# EasyEDA schematic schematic.json
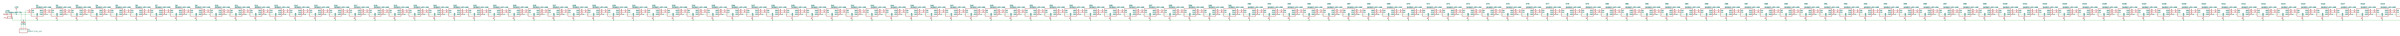
[diagram p0: schematic sheet]

## Parts
D1  SK9822 LED LINK  [SK9822 LED]
D2  SK9822 LED LINK  [SK9822 LED]
D3  SK9822 LED LINK  [SK9822 LED]
D4  SK9822 LED LINK  [SK9822 LED]
D5  SK9822 LED LINK  [SK9822 LED]
D6  SK9822 LED LINK  [SK9822 LED]
D7  SK9822 LED LINK  [SK9822 LED]
D8  SK9822 LED LINK  [SK9822 LED]
D9  SK9822 LED LINK  [SK9822 LED]
D10  SK9822 LED LINK  [SK9822 LED]
D11  SK9822 LED LINK  [SK9822 LED]
D12  SK9822 LED LINK  [SK9822 LED]
D13  SK9822 LED LINK  [SK9822 LED]
D14  SK9822 LED LINK  [SK9822 LED]
D15  SK9822 LED LINK  [SK9822 LED]
D16  SK9822 LED LINK  [SK9822 LED]
D17  SK9822 LED LINK  [SK9822 LED]
D18  SK9822 LED LINK  [SK9822 LED]
D19  SK9822 LED LINK  [SK9822 LED]
D20  SK9822 LED LINK  [SK9822 LED]
D21  SK9822 LED LINK  [SK9822 LED]
D22  SK9822 LED LINK  [SK9822 LED]
D23  SK9822 LED LINK  [SK9822 LED]
D24  SK9822 LED LINK  [SK9822 LED]
D25  SK9822 LED LINK  [SK9822 LED]
D26  SK9822 LED LINK  [SK9822 LED]
D27  SK9822 LED LINK  [SK9822 LED]
D28  SK9822 LED LINK  [SK9822 LED]
D29  SK9822 LED LINK  [SK9822 LED]
D30  SK9822 LED LINK  [SK9822 LED]
D31  SK9822 LED LINK  [SK9822 LED]
D32  SK9822 LED LINK  [SK9822 LED]
D33  SK9822 LED LINK  [SK9822 LED]
D34  SK9822 LED LINK  [SK9822 LED]
D35  SK9822 LED LINK  [SK9822 LED]
D36  SK9822 LED LINK  [SK9822 LED]
D37  SK9822 LED LINK  [SK9822 LED]
D38  SK9822 LED LINK  [SK9822 LED]
D39  SK9822 LED LINK  [SK9822 LED]
D40  SK9822 LED LINK  [SK9822 LED]
D41  SK9822 LED LINK  [SK9822 LED]
D42  SK9822 LED LINK  [SK9822 LED]
D43  SK9822 LED LINK  [SK9822 LED]
D44  SK9822 LED LINK  [SK9822 LED]
D45  SK9822 LED LINK  [SK9822 LED]
D46  SK9822 LED LINK  [SK9822 LED]
D47  SK9822 LED LINK  [SK9822 LED]
D48  SK9822 LED LINK  [SK9822 LED]
D49  SK9822 LED LINK  [SK9822 LED]
D50  SK9822 LED LINK  [SK9822 LED]
D51  SK9822 LED LINK  [SK9822 LED]
D52  SK9822 LED LINK  [SK9822 LED]
D53  SK9822 LED LINK  [SK9822 LED]
D54  SK9822 LED LINK  [SK9822 LED]
D55  SK9822 LED LINK  [SK9822 LED]
D56  SK9822 LED LINK  [SK9822 LED]
D57  SK9822 LED LINK  [SK9822 LED]
D58  SK9822 LED LINK  [SK9822 LED]
D59  SK9822 LED LINK  [SK9822 LED]
D60  SK9822 LED LINK  [SK9822 LED]
D61  SK9822 LED LINK  [SK9822 LED]
D62  SK9822 LED LINK  [SK9822 LED]
D63  SK9822 LED LINK  [SK9822 LED]
D64  SK9822 LED LINK  [SK9822 LED]
D65  SK9822 LED LINK  [SK9822 LED]
D66  SK9822 LED LINK  [SK9822 LED]
D67  SK9822 LED LINK  [SK9822 LED]
D68  SK9822 LED LINK  [SK9822 LED]
D69  SK9822 LED LINK  [SK9822 LED]
D70  SK9822 LED LINK  [SK9822 LED]
D71  SK9822 LED LINK  [SK9822 LED]
D72  SK9822 LED LINK  [SK9822 LED]
D73  SK9822 LED LINK  [SK9822 LED]
D74  SK9822 LED LINK  [SK9822 LED]
D75  SK9822 LED LINK  [SK9822 LED]
D76  SK9822 LED LINK  [SK9822 LED]
D77  SK9822 LED LINK  [SK9822 LED]
D78  SK9822 LED LINK  [SK9822 LED]
D79  SK9822 LED LINK  [SK9822 LED]
D80  SK9822 LED LINK  [SK9822 LED]
D81  SK9822 LED LINK  [SK9822 LED]
D82  SK9822 LED LINK  [SK9822 LED]
D83  SK9822 LED LINK  [SK9822 LED]
D84  SK9822 LED LINK  [SK9822 LED]
D85  SK9822 LED LINK  [SK9822 LED]
D86  SK9822 LED LINK  [SK9822 LED]
D87  SK9822 LED LINK  [SK9822 LED]
D88  SK9822 LED LINK  [SK9822 LED]
D89  SK9822 LED LINK  [SK9822 LED]
D90  SK9822 LED LINK  [SK9822 LED]
D91  SK9822 LED LINK  [SK9822 LED]
D92  SK9822 LED LINK  [SK9822 LED]
D93  SK9822 LED LINK  [SK9822 LED]
D94  SK9822 LED LINK  [SK9822 LED]
D95  SK9822 LED LINK  [SK9822 LED]
D96  SK9822 LED LINK  [SK9822 LED]
D97  SK9822 LED LINK  [SK9822 LED]
D98  SK9822 LED LINK  [SK9822 LED]
D99  SK9822 LED LINK  [SK9822 LED]
D100  SK9822 LED LINK  [SK9822 LED]
D101  SK9822 LED LINK  [SK9822 LED]
D102  SK9822 LED LINK  [SK9822 LED]
D103  SK9822 LED LINK  [SK9822 LED]
D104  SK9822 LED LINK  [SK9822 LED]
D105  SK9822 LED LINK  [SK9822 LED]
D106  SK9822 LED LINK  [SK9822 LED]
D107  SK9822 LED LINK  [SK9822 LED]
D108  SK9822 LED LINK  [SK9822 LED]
D109  SK9822 LED LINK  [SK9822 LED]
D110  SK9822 LED LINK  [SK9822 LED]
D111  SK9822 LED LINK  [SK9822 LED]
D112  SK9822 LED LINK  [SK9822 LED]
D113  SK9822 LED LINK  [SK9822 LED]
D114  SK9822 LED LINK  [SK9822 LED]
D115  SK9822 LED LINK  [SK9822 LED]
D116  SK9822 LED LINK  [SK9822 LED]
D117  SK9822 LED LINK  [SK9822 LED]
D118  SK9822 LED LINK  [SK9822 LED]
D119  SK9822 LED LINK  [SK9822 LED]
D120  SK9822 LED LINK  [SK9822 LED]
D121  SK9822 LED LINK  [SK9822 LED]
D122  SK9822 LED LINK  [SK9822 LED]
D123  SK9822 LED LINK  [SK9822 LED]
D124  SK9822 LED LINK  [SK9822 LED]
D125  SK9822 LED LINK  [SK9822 LED]
D126  SK9822 LED LINK  [SK9822 LED]
D127  SK9822 LED LINK  [SK9822 LED]
D128  SK9822 LED LINK  [SK9822 LED]
D129  SK9822 LED LINK  [SK9822 LED]
D130  SK9822 LED LINK  [SK9822 LED]
D131  SK9822 LED LINK  [SK9822 LED]
D132  SK9822 LED LINK  [SK9822 LED]
D133  SK9822 LED LINK  [SK9822 LED]
D134  SK9822 LED LINK  [SK9822 LED]
D135  SK9822 LED LINK  [SK9822 LED]
D136  SK9822 LED LINK  [SK9822 LED]
D137  SK9822 LED LINK  [SK9822 LED]
D138  SK9822 LED LINK  [SK9822 LED]
D139  SK9822 LED LINK  [SK9822 LED]
D140  SK9822 LED LINK  [SK9822 LED]
D141  SK9822 LED LINK  [SK9822 LED]
D142  SK9822 LED LINK  [SK9822 LED]
D143  SK9822 LED LINK  [SK9822 LED]
D144  SK9822 LED LINK  [SK9822 LED]
D145  SK9822 LED LINK  [SK9822 LED]
D146  SK9822 LED LINK  [SK9822 LED]
D147  SK9822 LED LINK  [SK9822 LED]
D148  SK9822 LED LINK  [SK9822 LED]
D149  SK9822 LED LINK  [SK9822 LED]
D150  SK9822 LED LINK  [SK9822 LED]
D151  SK9822 LED LINK  [SK9822 LED]
D152  SK9822 LED LINK  [SK9822 LED]
D153  SK9822 LED LINK  [SK9822 LED]
D154  SK9822 LED LINK  [SK9822 LED]
D155  SK9822 LED LINK  [SK9822 LED]
D156  SK9822 LED LINK  [SK9822 LED]
D157  SK9822 LED LINK  [SK9822 LED]
D158  SK9822 LED LINK  [SK9822 LED]
D159  SK9822 LED LINK  [SK9822 LED]
D160  SK9822 LED LINK  [SK9822 LED]
D161  SK9822 LED LINK  [SK9822 LED]
D162  SK9822 LED LINK  [SK9822 LED]
D163  SK9822 LED LINK  [SK9822 LED]
D164  SK9822 LED LINK  [SK9822 LED]
D165  SK9822 LED LINK  [SK9822 LED]
D166  SK9822 LED LINK  [SK9822 LED]
D167  SK9822 LED LINK  [SK9822 LED]
D168  SK9822 LED LINK  [SK9822 LED]
D169  SK9822 LED LINK  [SK9822 LED]
D170  SK9822 LED LINK  [SK9822 LED]
D171  SK9822 LED LINK  [SK9822 LED]
D172  SK9822 LED LINK  [SK9822 LED]
D173  SK9822 LED LINK  [SK9822 LED]
D174  SK9822 LED LINK  [SK9822 LED]
D175  SK9822 LED LINK  [SK9822 LED]
D176  SK9822 LED LINK  [SK9822 LED]
D177  SK9822 LED LINK  [SK9822 LED]
D178  SK9822 LED LINK  [SK9822 LED]
D179  SK9822 LED LINK  [SK9822 LED]
D180  SK9822 LED LINK  [SK9822 LED]
D181  SK9822 LED LINK  [SK9822 LED]
D182  SK9822 LED LINK  [SK9822 LED]
D183  SK9822 LED LINK  [SK9822 LED]
D184  SK9822 LED LINK  [SK9822 LED]
D185  SK9822 LED LINK  [SK9822 LED]
D186  SK9822 LED LINK  [SK9822 LED]
D187  SK9822 LED LINK  [SK9822 LED]
D188  SK9822 LED LINK  [SK9822 LED]
D189  SK9822 LED LINK  [SK9822 LED]
D190  SK9822 LED LINK  [SK9822 LED]
D191  SK9822 LED LINK  [SK9822 LED]
D192  SK9822 LED LINK  [SK9822 LED]
D193  SK9822 LED LINK  [SK9822 LED]
D194  SK9822 LED LINK  [SK9822 LED]
D195  SK9822 LED LINK  [SK9822 LED]
D196  SK9822 LED LINK  [SK9822 LED]
D197  SK9822 LED LINK  [SK9822 LED]
D198  SK9822 LED LINK  [SK9822 LED]
D199  SK9822 LED LINK  [SK9822 LED]
D200  SK9822 LED LINK  [SK9822 LED]
D201  SK9822 LED LINK  [SK9822 LED]
D202  SK9822 LED LINK  [SK9822 LED]
D203  SK9822 LED LINK  [SK9822 LED]
D204  SK9822 LED LINK  [SK9822 LED]
D205  SK9822 LED LINK  [SK9822 LED]
D206  SK9822 LED LINK  [SK9822 LED]
D207  SK9822 LED LINK  [SK9822 LED]
D208  SK9822 LED LINK  [SK9822 LED]
D209  SK9822 LED LINK  [SK9822 LED]
D210  SK9822 LED LINK  [SK9822 LED]
D211  SK9822 LED LINK  [SK9822 LED]
D212  SK9822 LED LINK  [SK9822 LED]
D213  SK9822 LED LINK  [SK9822 LED]
D214  SK9822 LED LINK  [SK9822 LED]
D215  SK9822 LED LINK  [SK9822 LED]
D216  SK9822 LED LINK  [SK9822 LED]
D217  SK9822 LED LINK  [SK9822 LED]
D218  SK9822 LED LINK  [SK9822 LED]
D219  SK9822 LED LINK  [SK9822 LED]
D220  SK9822 LED LINK  [SK9822 LED]
D221  SK9822 LED LINK  [SK9822 LED]
D222  SK9822 LED LINK  [SK9822 LED]
D223  SK9822 LED LINK  [SK9822 LED]
D224  SK9822 LED LINK  [SK9822 LED]
D225  SK9822 LED LINK  [SK9822 LED]
D226  SK9822 LED LINK  [SK9822 LED]
D227  SK9822 LED LINK  [SK9822 LED]
D228  SK9822 LED LINK  [SK9822 LED]
D229  SK9822 LED LINK  [SK9822 LED]
D230  SK9822 LED LINK  [SK9822 LED]
D231  SK9822 LED LINK  [SK9822 LED]
D232  SK9822 LED LINK  [SK9822 LED]
D233  SK9822 LED LINK  [SK9822 LED]
D234  SK9822 LED LINK  [SK9822 LED]
D235  SK9822 LED LINK  [SK9822 LED]
D236  SK9822 LED LINK  [SK9822 LED]
D237  SK9822 LED LINK  [SK9822 LED]
D238  SK9822 LED LINK  [SK9822 LED]
D239  SK9822 LED LINK  [SK9822 LED]
D240  SK9822 LED LINK  [SK9822 LED]
D241  SK9822 LED LINK  [SK9822 LED]
D242  SK9822 LED LINK  [SK9822 LED]
D243  SK9822 LED LINK  [SK9822 LED]
D244  SK9822 LED LINK  [SK9822 LED]
D245  SK9822 LED LINK  [SK9822 LED]
D246  SK9822 LED LINK  [SK9822 LED]
D247  SK9822 LED LINK  [SK9822 LED]
D248  SK9822 LED LINK  [SK9822 LED]
D249  SK9822 LED LINK  [SK9822 LED]
D250  SK9822 LED LINK  [SK9822 LED]
D251  SK9822 LED LINK  [SK9822 LED]
D252  SK9822 LED LINK  [SK9822 LED]
D253  SK9822 LED LINK  [SK9822 LED]
D254  SK9822 LED LINK  [SK9822 LED]
D255  SK9822 LED LINK  [SK9822 LED]
D256  SK9822 LED LINK  [SK9822 LED]
D257  SK9822 LED LINK  [SK9822 LED]
D258  SK9822 LED LINK  [SK9822 LED]
D259  SK9822 LED LINK  [SK9822 LED]
D260  SK9822 LED LINK  [SK9822 LED]
D261  SK9822 LED LINK  [SK9822 LED]
D262  SK9822 LED LINK  [SK9822 LED]
D263  SK9822 LED LINK  [SK9822 LED]
D264  SK9822 LED LINK  [SK9822 LED]
D265  SK9822 LED LINK  [SK9822 LED]
D266  SK9822 LED LINK  [SK9822 LED]
D267  SK9822 LED LINK  [SK9822 LED]
D268  SK9822 LED LINK  [SK9822 LED]
D269  SK9822 LED LINK  [SK9822 LED]
D270  SK9822 LED LINK  [SK9822 LED]
D271  SK9822 LED LINK  [SK9822 LED]
D272  SK9822 LED LINK  [SK9822 LED]
D273  SK9822 LED LINK  [SK9822 LED]
D274  SK9822 LED LINK  [SK9822 LED]
D275  SK9822 LED LINK  [SK9822 LED]
D276  SK9822 LED LINK  [SK9822 LED]
D277  SK9822 LED LINK  [SK9822 LED]
D278  SK9822 LED LINK  [SK9822 LED]
D279  SK9822 LED LINK  [SK9822 LED]
D280  SK9822 LED LINK  [SK9822 LED]
D281  SK9822 LED LINK  [SK9822 LED]
D282  SK9822 LED LINK  [SK9822 LED]
D283  SK9822 LED LINK  [SK9822 LED]
D284  SK9822 LED LINK  [SK9822 LED]
D285  SK9822 LED LINK  [SK9822 LED]
D286  SK9822 LED LINK  [SK9822 LED]
D287  SK9822 LED LINK  [SK9822 LED]
D288  SK9822 LED LINK  [SK9822 LED]
D289  SK9822 LED LINK  [SK9822 LED]
D290  SK9822 LED LINK  [SK9822 LED]
D291  SK9822 LED LINK  [SK9822 LED]
D292  SK9822 LED LINK  [SK9822 LED]
D293  SK9822 LED LINK  [SK9822 LED]
D294  SK9822 LED LINK  [SK9822 LED]
D295  SK9822 LED LINK  [SK9822 LED]
D296  SK9822 LED LINK  [SK9822 LED]
D297  SK9822 LED LINK  [SK9822 LED]
D298  SK9822 LED LINK  [SK9822 LED]
D299  SK9822 LED LINK  [SK9822 LED]
D300  SK9822 LED LINK  [SK9822 LED]
D301  SK9822 LED LINK  [SK9822 LED]
D302  SK9822 LED LINK  [SK9822 LED]
D303  SK9822 LED LINK  [SK9822 LED]
D304  SK9822 LED LINK  [SK9822 LED]
D305  SK9822 LED LINK  [SK9822 LED]
D306  SK9822 LED LINK  [SK9822 LED]
D307  SK9822 LED LINK  [SK9822 LED]
D308  SK9822 LED LINK  [SK9822 LED]
D309  SK9822 LED LINK  [SK9822 LED]
D310  SK9822 LED LINK  [SK9822 LED]
D311  SK9822 LED LINK  [SK9822 LED]
D312  SK9822 LED LINK  [SK9822 LED]
D313  SK9822 LED LINK  [SK9822 LED]
D314  SK9822 LED LINK  [SK9822 LED]
D315  SK9822 LED LINK  [SK9822 LED]
D316  SK9822 LED LINK  [SK9822 LED]
D317  SK9822 LED LINK  [SK9822 LED]
D318  SK9822 LED LINK  [SK9822 LED]
D319  SK9822 LED LINK  [SK9822 LED]
D320  SK9822 LED LINK  [SK9822 LED]
D321  SK9822 LED LINK  [SK9822 LED]
D322  SK9822 LED LINK  [SK9822 LED]
D323  SK9822 LED LINK  [SK9822 LED]
D324  SK9822 LED LINK  [SK9822 LED]
D325  SK9822 LED LINK  [SK9822 LED]
D326  SK9822 LED LINK  [SK9822 LED]
D327  SK9822 LED LINK  [SK9822 LED]
D328  SK9822 LED LINK  [SK9822 LED]
D329  SK9822 LED LINK  [SK9822 LED]
D330  SK9822 LED LINK  [SK9822 LED]
D331  SK9822 LED LINK  [SK9822 LED]
D332  SK9822 LED LINK  [SK9822 LED]
D333  SK9822 LED LINK  [SK9822 LED]
D334  SK9822 LED LINK  [SK9822 LED]
D335  SK9822 LED LINK  [SK9822 LED]
D336  SK9822 LED LINK  [SK9822 LED]
D337  SK9822 LED LINK  [SK9822 LED]
D338  SK9822 LED LINK  [SK9822 LED]
D339  SK9822 LED LINK  [SK9822 LED]
D340  SK9822 LED LINK  [SK9822 LED]
D341  SK9822 LED LINK  [SK9822 LED]
D342  SK9822 LED LINK  [SK9822 LED]
D343  SK9822 LED LINK  [SK9822 LED]
D344  SK9822 LED LINK  [SK9822 LED]
D345  SK9822 LED LINK  [SK9822 LED]
D346  SK9822 LED LINK  [SK9822 LED]
D347  SK9822 LED LINK  [SK9822 LED]
D348  SK9822 LED LINK  [SK9822 LED]
D349  SK9822 LED LINK  [SK9822 LED]
D350  SK9822 LED LINK  [SK9822 LED]
D351  SK9822 LED LINK  [SK9822 LED]
D352  SK9822 LED LINK  [SK9822 LED]
D353  SK9822 LED LINK  [SK9822 LED]
D354  SK9822 LED LINK  [SK9822 LED]
D355  SK9822 LED LINK  [SK9822 LED]
D356  SK9822 LED LINK  [SK9822 LED]
D357  SK9822 LED LINK  [SK9822 LED]
D358  SK9822 LED LINK  [SK9822 LED]
D359  SK9822 LED LINK  [SK9822 LED]
D360  SK9822 LED LINK  [SK9822 LED]
D361  SK9822 LED LINK  [SK9822 LED]
D362  SK9822 LED LINK  [SK9822 LED]
D363  SK9822 LED LINK  [SK9822 LED]
D364  SK9822 LED LINK  [SK9822 LED]
D365  SK9822 LED LINK  [SK9822 LED]
D366  SK9822 LED LINK  [SK9822 LED]
D367  SK9822 LED LINK  [SK9822 LED]
D368  SK9822 LED LINK  [SK9822 LED]
D369  SK9822 LED LINK  [SK9822 LED]
D370  SK9822 LED LINK  [SK9822 LED]
D371  SK9822 LED LINK  [SK9822 LED]
D372  SK9822 LED LINK  [SK9822 LED]
D373  SK9822 LED LINK  [SK9822 LED]
D374  SK9822 LED LINK  [SK9822 LED]
D375  SK9822 LED LINK  [SK9822 LED]
D376  SK9822 LED LINK  [SK9822 LED]
D377  SK9822 LED LINK  [SK9822 LED]
D378  SK9822 LED LINK  [SK9822 LED]
D379  SK9822 LED LINK  [SK9822 LED]
D380  SK9822 LED LINK  [SK9822 LED]
D381  SK9822 LED LINK  [SK9822 LED]
D382  SK9822 LED LINK  [SK9822 LED]
D383  SK9822 LED LINK  [SK9822 LED]
D384  SK9822 LED LINK  [SK9822 LED]
D385  SK9822 LED LINK  [SK9822 LED]
D386  SK9822 LED LINK  [SK9822 LED]
D387  SK9822 LED LINK  [SK9822 LED]
D388  SK9822 LED LINK  [SK9822 LED]
D389  SK9822 LED LINK  [SK9822 LED]
D390  SK9822 LED LINK  [SK9822 LED]
D391  SK9822 LED LINK  [SK9822 LED]
D392  SK9822 LED LINK  [SK9822 LED]
D393  SK9822 LED LINK  [SK9822 LED]
D394  SK9822 LED LINK  [SK9822 LED]
D395  SK9822 LED LINK  [SK9822 LED]
D396  SK9822 LED LINK  [SK9822 LED]
D397  SK9822 LED LINK  [SK9822 LED]
D398  SK9822 LED LINK  [SK9822 LED]
D399  SK9822 LED LINK  [SK9822 LED]
D400  SK9822 LED LINK  [SK9822 LED]
D401  SK9822 LED LINK  [SK9822 LED]
D402  SK9822 LED LINK  [SK9822 LED]
D403  SK9822 LED LINK  [SK9822 LED]
D404  SK9822 LED LINK  [SK9822 LED]
D405  SK9822 LED LINK  [SK9822 LED]
D406  SK9822 LED LINK  [SK9822 LED]
D407  SK9822 LED LINK  [SK9822 LED]
D408  SK9822 LED LINK  [SK9822 LED]
D409  SK9822 LED LINK  [SK9822 LED]
D410  SK9822 LED LINK  [SK9822 LED]
D411  SK9822 LED LINK  [SK9822 LED]
D412  SK9822 LED LINK  [SK9822 LED]
D413  SK9822 LED LINK  [SK9822 LED]
D414  SK9822 LED LINK  [SK9822 LED]
D415  SK9822 LED LINK  [SK9822 LED]
D416  SK9822 LED LINK  [SK9822 LED]
D417  SK9822 LED LINK  [SK9822 LED]
D418  SK9822 LED LINK  [SK9822 LED]
D419  SK9822 LED LINK  [SK9822 LED]
D420  SK9822 LED LINK  [SK9822 LED]
D421  SK9822 LED LINK  [SK9822 LED]
D422  SK9822 LED LINK  [SK9822 LED]
D423  SK9822 LED LINK  [SK9822 LED]
D424  SK9822 LED LINK  [SK9822 LED]
D425  SK9822 LED LINK  [SK9822 LED]
D426  SK9822 LED LINK  [SK9822 LED]
D427  SK9822 LED LINK  [SK9822 LED]
D428  SK9822 LED LINK  [SK9822 LED]
D429  SK9822 LED LINK  [SK9822 LED]
D430  SK9822 LED LINK  [SK9822 LED]
D431  SK9822 LED LINK  [SK9822 LED]
D432  SK9822 LED LINK  [SK9822 LED]
D433  SK9822 LED LINK  [SK9822 LED]
D434  SK9822 LED LINK  [SK9822 LED]
D435  SK9822 LED LINK  [SK9822 LED]
D436  SK9822 LED LINK  [SK9822 LED]
D437  SK9822 LED LINK  [SK9822 LED]
D438  SK9822 LED LINK  [SK9822 LED]
D439  SK9822 LED LINK  [SK9822 LED]
D440  SK9822 LED LINK  [SK9822 LED]
D441  SK9822 LED LINK  [SK9822 LED]
D442  SK9822 LED LINK  [SK9822 LED]
D443  SK9822 LED LINK  [SK9822 LED]
D444  SK9822 LED LINK  [SK9822 LED]
D445  SK9822 LED LINK  [SK9822 LED]
D446  SK9822 LED LINK  [SK9822 LED]
D447  SK9822 LED LINK  [SK9822 LED]
D448  SK9822 LED LINK  [SK9822 LED]
D449  SK9822 LED LINK  [SK9822 LED]
D450  SK9822 LED LINK  [SK9822 LED]
D451  SK9822 LED LINK  [SK9822 LED]
D452  SK9822 LED LINK  [SK9822 LED]
D453  SK9822 LED LINK  [SK9822 LED]
D454  SK9822 LED LINK  [SK9822 LED]
D455  SK9822 LED LINK  [SK9822 LED]
D456  SK9822 LED LINK  [SK9822 LED]
D457  SK9822 LED LINK  [SK9822 LED]
D458  SK9822 LED LINK  [SK9822 LED]
D459  SK9822 LED LINK  [SK9822 LED]
D460  SK9822 LED LINK  [SK9822 LED]
D461  SK9822 LED LINK  [SK9822 LED]
D462  SK9822 LED LINK  [SK9822 LED]
D463  SK9822 LED LINK  [SK9822 LED]
D464  SK9822 LED LINK  [SK9822 LED]
D465  SK9822 LED LINK  [SK9822 LED]
D466  SK9822 LED LINK  [SK9822 LED]
D467  SK9822 LED LINK  [SK9822 LED]
D468  SK9822 LED LINK  [SK9822 LED]
D469  SK9822 LED LINK  [SK9822 LED]
D470  SK9822 LED LINK  [SK9822 LED]
D471  SK9822 LED LINK  [SK9822 LED]
D472  SK9822 LED LINK  [SK9822 LED]
D473  SK9822 LED LINK  [SK9822 LED]
D474  SK9822 LED LINK  [SK9822 LED]
D475  SK9822 LED LINK  [SK9822 LED]
D476  SK9822 LED LINK  [SK9822 LED]
D477  SK9822 LED LINK  [SK9822 LED]
D478  SK9822 LED LINK  [SK9822 LED]
D479  SK9822 LED LINK  [SK9822 LED]
D480  SK9822 LED LINK  [SK9822 LED]
D481  SK9822 LED LINK  [SK9822 LED]
D482  SK9822 LED LINK  [SK9822 LED]
D483  SK9822 LED LINK  [SK9822 LED]
D484  SK9822 LED LINK  [SK9822 LED]
D485  SK9822 LED LINK  [SK9822 LED]
D486  SK9822 LED LINK  [SK9822 LED]
D487  SK9822 LED LINK  [SK9822 LED]
D488  SK9822 LED LINK  [SK9822 LED]
D489  SK9822 LED LINK  [SK9822 LED]
D490  SK9822 LED LINK  [SK9822 LED]
D491  SK9822 LED LINK  [SK9822 LED]
D492  SK9822 LED LINK  [SK9822 LED]
D493  SK9822 LED LINK  [SK9822 LED]
D494  SK9822 LED LINK  [SK9822 LED]
D495  SK9822 LED LINK  [SK9822 LED]
D496  SK9822 LED LINK  [SK9822 LED]
D497  SK9822 LED LINK  [SK9822 LED]
D498  SK9822 LED LINK  [SK9822 LED]
D499  SK9822 LED LINK  [SK9822 LED]
D500  SK9822 LED LINK  [SK9822 LED]
D501  SK9822 LED LINK  [SK9822 LED]
D502  SK9822 LED LINK  [SK9822 LED]
D503  SK9822 LED LINK  [SK9822 LED]
D504  SK9822 LED LINK  [SK9822 LED]
D505  SK9822 LED LINK  [SK9822 LED]
D506  SK9822 LED LINK  [SK9822 LED]
D507  SK9822 LED LINK  [SK9822 LED]
D508  SK9822 LED LINK  [SK9822 LED]
D509  SK9822 LED LINK  [SK9822 LED]
D510  SK9822 LED LINK  [SK9822 LED]
D511  SK9822 LED LINK  [SK9822 LED]
D512  SK9822 LED LINK  [SK9822 LED]
D513  SK9822 LED LINK  [SK9822 LED]
D514  SK9822 LED LINK  [SK9822 LED]
D515  SK9822 LED LINK  [SK9822 LED]
D516  SK9822 LED LINK  [SK9822 LED]
D517  SK9822 LED LINK  [SK9822 LED]
D518  SK9822 LED LINK  [SK9822 LED]
D519  SK9822 LED LINK  [SK9822 LED]
D520  SK9822 LED LINK  [SK9822 LED]
D521  SK9822 LED LINK  [SK9822 LED]
D522  SK9822 LED LINK  [SK9822 LED]
D523  SK9822 LED LINK  [SK9822 LED]
D524  SK9822 LED LINK  [SK9822 LED]
D525  SK9822 LED LINK  [SK9822 LED]
D526  SK9822 LED LINK  [SK9822 LED]
D527  SK9822 LED LINK  [SK9822 LED]
D528  SK9822 LED LINK  [SK9822 LED]
D529  SK9822 LED LINK  [SK9822 LED]
D530  SK9822 LED LINK  [SK9822 LED]
D531  SK9822 LED LINK  [SK9822 LED]
D532  SK9822 LED LINK  [SK9822 LED]
D533  SK9822 LED LINK  [SK9822 LED]
D534  SK9822 LED LINK  [SK9822 LED]
D535  SK9822 LED LINK  [SK9822 LED]
D536  SK9822 LED LINK  [SK9822 LED]
D537  SK9822 LED LINK  [SK9822 LED]
D538  SK9822 LED LINK  [SK9822 LED]
D539  SK9822 LED LINK  [SK9822 LED]
D540  SK9822 LED LINK  [SK9822 LED]
D541  SK9822 LED LINK  [SK9822 LED]
D542  SK9822 LED LINK  [SK9822 LED]
D543  SK9822 LED LINK  [SK9822 LED]
D544  SK9822 LED LINK  [SK9822 LED]
D545  SK9822 LED LINK  [SK9822 LED]
D546  SK9822 LED LINK  [SK9822 LED]
D547  SK9822 LED LINK  [SK9822 LED]
D548  SK9822 LED LINK  [SK9822 LED]
D549  SK9822 LED LINK  [SK9822 LED]
D550  SK9822 LED LINK  [SK9822 LED]
D551  SK9822 LED LINK  [SK9822 LED]
D552  SK9822 LED LINK  [SK9822 LED]
D553  SK9822 LED LINK  [SK9822 LED]
D554  SK9822 LED LINK  [SK9822 LED]
D555  SK9822 LED LINK  [SK9822 LED]
D556  SK9822 LED LINK  [SK9822 LED]
D557  SK9822 LED LINK  [SK9822 LED]
D558  SK9822 LED LINK  [SK9822 LED]
D559  SK9822 LED LINK  [SK9822 LED]
D560  SK9822 LED LINK  [SK9822 LED]
D561  SK9822 LED LINK  [SK9822 LED]
D562  SK9822 LED LINK  [SK9822 LED]
D563  SK9822 LED LINK  [SK9822 LED]
D564  SK9822 LED LINK  [SK9822 LED]
D565  SK9822 LED LINK  [SK9822 LED]
D566  SK9822 LED LINK  [SK9822 LED]
D567  SK9822 LED LINK  [SK9822 LED]
D568  SK9822 LED LINK  [SK9822 LED]
D569  SK9822 LED LINK  [SK9822 LED]
D570  SK9822 LED LINK  [SK9822 LED]
D571  SK9822 LED LINK  [SK9822 LED]
D572  SK9822 LED LINK  [SK9822 LED]
D573  SK9822 LED LINK  [SK9822 LED]
D574  SK9822 LED LINK  [SK9822 LED]
D575  SK9822 LED LINK  [SK9822 LED]
D576  SK9822 LED LINK  [SK9822 LED]
D577  SK9822 LED LINK  [SK9822 LED]
D578  SK9822 LED LINK  [SK9822 LED]
D579  SK9822 LED LINK  [SK9822 LED]
D580  SK9822 LED LINK  [SK9822 LED]
D581  SK9822 LED LINK  [SK9822 LED]
D582  SK9822 LED LINK  [SK9822 LED]
D583  SK9822 LED LINK  [SK9822 LED]
D584  SK9822 LED LINK  [SK9822 LED]
D585  SK9822 LED LINK  [SK9822 LED]
D586  SK9822 LED LINK  [SK9822 LED]
D587  SK9822 LED LINK  [SK9822 LED]
D588  SK9822 LED LINK  [SK9822 LED]
D589  SK9822 LED LINK  [SK9822 LED]
D590  SK9822 LED LINK  [SK9822 LED]
D591  SK9822 LED LINK  [SK9822 LED]
D592  SK9822 LED LINK  [SK9822 LED]
D593  SK9822 LED LINK  [SK9822 LED]
D594  SK9822 LED LINK  [SK9822 LED]
D595  SK9822 LED LINK  [SK9822 LED]
D596  SK9822 LED LINK  [SK9822 LED]
D597  SK9822 LED LINK  [SK9822 LED]
D598  SK9822 LED LINK  [SK9822 LED]
D599  SK9822 LED LINK  [SK9822 LED]
D600  SK9822 LED LINK  [SK9822 LED]
D601  SK9822 LED LINK  [SK9822 LED]
D602  SK9822 LED LINK  [SK9822 LED]
D603  SK9822 LED LINK  [SK9822 LED]
D604  SK9822 LED LINK  [SK9822 LED]
D605  SK9822 LED LINK  [SK9822 LED]
D606  SK9822 LED LINK  [SK9822 LED]
D607  SK9822 LED LINK  [SK9822 LED]
D608  SK9822 LED LINK  [SK9822 LED]
D609  SK9822 LED LINK  [SK9822 LED]
D610  SK9822 LED LINK  [SK9822 LED]
D611  SK9822 LED LINK  [SK9822 LED]
D612  SK9822 LED LINK  [SK9822 LED]
D613  SK9822 LED LINK  [SK9822 LED]
D614  SK9822 LED LINK  [SK9822 LED]
D615  SK9822 LED LINK  [SK9822 LED]
D616  SK9822 LED LINK  [SK9822 LED]
D617  SK9822 LED LINK  [SK9822 LED]
D618  SK9822 LED LINK  [SK9822 LED]
D619  SK9822 LED LINK  [SK9822 LED]
D620  SK9822 LED LINK  [SK9822 LED]
D621  SK9822 LED LINK  [SK9822 LED]
D622  SK9822 LED LINK  [SK9822 LED]
D623  SK9822 LED LINK  [SK9822 LED]
D624  SK9822 LED LINK  [SK9822 LED]
D625  SK9822 LED LINK  [SK9822 LED]
D626  SK9822 LED LINK  [SK9822 LED]
D627  SK9822 LED LINK  [SK9822 LED]
D628  SK9822 LED LINK  [SK9822 LED]
D629  SK9822 LED LINK  [SK9822 LED]
D630  SK9822 LED LINK  [SK9822 LED]
D631  SK9822 LED LINK  [SK9822 LED]
D632  SK9822 LED LINK  [SK9822 LED]
D633  SK9822 LED LINK  [SK9822 LED]
D634  SK9822 LED LINK  [SK9822 LED]
D635  SK9822 LED LINK  [SK9822 LED]
D636  SK9822 LED LINK  [SK9822 LED]
D637  SK9822 LED LINK  [SK9822 LED]
D638  SK9822 LED LINK  [SK9822 LED]
D639  SK9822 LED LINK  [SK9822 LED]
D640  SK9822 LED LINK  [SK9822 LED]
D641  SK9822 LED LINK  [SK9822 LED]
D642  SK9822 LED LINK  [SK9822 LED]
D643  SK9822 LED LINK  [SK9822 LED]
D644  SK9822 LED LINK  [SK9822 LED]
D645  SK9822 LED LINK  [SK9822 LED]
D646  SK9822 LED LINK  [SK9822 LED]
D647  SK9822 LED LINK  [SK9822 LED]
D648  SK9822 LED LINK  [SK9822 LED]
D649  SK9822 LED LINK  [SK9822 LED]
D650  SK9822 LED LINK  [SK9822 LED]
D651  SK9822 LED LINK  [SK9822 LED]
D652  SK9822 LED LINK  [SK9822 LED]
D653  SK9822 LED LINK  [SK9822 LED]
D654  SK9822 LED LINK  [SK9822 LED]
D655  SK9822 LED LINK  [SK9822 LED]
D656  SK9822 LED LINK  [SK9822 LED]
D657  SK9822 LED LINK  [SK9822 LED]
D658  SK9822 LED LINK  [SK9822 LED]
D659  SK9822 LED LINK  [SK9822 LED]
D660  SK9822 LED LINK  [SK9822 LED]
D661  SK9822 LED LINK  [SK9822 LED]
D662  SK9822 LED LINK  [SK9822 LED]
D663  SK9822 LED LINK  [SK9822 LED]
D664  SK9822 LED LINK  [SK9822 LED]
D665  SK9822 LED LINK  [SK9822 LED]
D666  SK9822 LED LINK  [SK9822 LED]
D667  SK9822 LED LINK  [SK9822 LED]
D668  SK9822 LED LINK  [SK9822 LED]
D669  SK9822 LED LINK  [SK9822 LED]
D670  SK9822 LED LINK  [SK9822 LED]
D671  SK9822 LED LINK  [SK9822 LED]
D672  SK9822 LED LINK  [SK9822 LED]
D673  SK9822 LED LINK  [SK9822 LED]
D674  SK9822 LED LINK  [SK9822 LED]
D675  SK9822 LED LINK  [SK9822 LED]
D676  SK9822 LED LINK  [SK9822 LED]
D677  SK9822 LED LINK  [SK9822 LED]
D678  SK9822 LED LINK  [SK9822 LED]
D679  SK9822 LED LINK  [SK9822 LED]
D680  SK9822 LED LINK  [SK9822 LED]
D681  SK9822 LED LINK  [SK9822 LED]
D682  SK9822 LED LINK  [SK9822 LED]
D683  SK9822 LED LINK  [SK9822 LED]
D684  SK9822 LED LINK  [SK9822 LED]
D685  SK9822 LED LINK  [SK9822 LED]
D686  SK9822 LED LINK  [SK9822 LED]
D687  SK9822 LED LINK  [SK9822 LED]
D688  SK9822 LED LINK  [SK9822 LED]
D689  SK9822 LED LINK  [SK9822 LED]
D690  SK9822 LED LINK  [SK9822 LED]
D691  SK9822 LED LINK  [SK9822 LED]
D692  SK9822 LED LINK  [SK9822 LED]
D693  SK9822 LED LINK  [SK9822 LED]
D694  SK9822 LED LINK  [SK9822 LED]
D695  SK9822 LED LINK  [SK9822 LED]
D696  SK9822 LED LINK  [SK9822 LED]
D697  SK9822 LED LINK  [SK9822 LED]
D698  SK9822 LED LINK  [SK9822 LED]
D699  SK9822 LED LINK  [SK9822 LED]
D700  SK9822 LED LINK  [SK9822 LED]
D701  SK9822 LED LINK  [SK9822 LED]
D702  SK9822 LED LINK  [SK9822 LED]
D703  SK9822 LED LINK  [SK9822 LED]
D704  SK9822 LED LINK  [SK9822 LED]
D705  SK9822 LED LINK  [SK9822 LED]
D706  SK9822 LED LINK  [SK9822 LED]
D707  SK9822 LED LINK  [SK9822 LED]
D708  SK9822 LED LINK  [SK9822 LED]
D709  SK9822 LED LINK  [SK9822 LED]
D710  SK9822 LED LINK  [SK9822 LED]
D711  SK9822 LED LINK  [SK9822 LED]
D712  SK9822 LED LINK  [SK9822 LED]
D713  SK9822 LED LINK  [SK9822 LED]
D714  SK9822 LED LINK  [SK9822 LED]
D715  SK9822 LED LINK  [SK9822 LED]
D716  SK9822 LED LINK  [SK9822 LED]
D717  SK9822 LED LINK  [SK9822 LED]
D718  SK9822 LED LINK  [SK9822 LED]
D719  SK9822 LED LINK  [SK9822 LED]
D720  SK9822 LED LINK  [SK9822 LED]
D721  SK9822 LED LINK  [SK9822 LED]
D722  SK9822 LED LINK  [SK9822 LED]
D723  SK9822 LED LINK  [SK9822 LED]
D724  SK9822 LED LINK  [SK9822 LED]
D725  SK9822 LED LINK  [SK9822 LED]
D726  SK9822 LED LINK  [SK9822 LED]
D727  SK9822 LED LINK  [SK9822 LED]
D728  SK9822 LED LINK  [SK9822 LED]
D729  SK9822 LED LINK  [SK9822 LED]
D730  SK9822 LED LINK  [SK9822 LED]
D731  SK9822 LED LINK  [SK9822 LED]
D732  SK9822 LED LINK  [SK9822 LED]
D733  SK9822 LED LINK  [SK9822 LED]
D734  SK9822 LED LINK  [SK9822 LED]
D735  SK9822 LED LINK  [SK9822 LED]
D736  SK9822 LED LINK  [SK9822 LED]
D737  SK9822 LED LINK  [SK9822 LED]
D738  SK9822 LED LINK  [SK9822 LED]
D739  SK9822 LED LINK  [SK9822 LED]
D740  SK9822 LED LINK  [SK9822 LED]
D741  SK9822 LED LINK  [SK9822 LED]
D742  SK9822 LED LINK  [SK9822 LED]
D743  SK9822 LED LINK  [SK9822 LED]
D744  SK9822 LED LINK  [SK9822 LED]
D745  SK9822 LED LINK  [SK9822 LED]
D746  SK9822 LED LINK  [SK9822 LED]
D747  SK9822 LED LINK  [SK9822 LED]
D748  SK9822 LED LINK  [SK9822 LED]
D749  SK9822 LED LINK  [SK9822 LED]
D750  SK9822 LED LINK  [SK9822 LED]
D751  SK9822 LED LINK  [SK9822 LED]
D752  SK9822 LED LINK  [SK9822 LED]
D753  SK9822 LED LINK  [SK9822 LED]
D754  SK9822 LED LINK  [SK9822 LED]
D755  SK9822 LED LINK  [SK9822 LED]
D756  SK9822 LED LINK  [SK9822 LED]
D757  SK9822 LED LINK  [SK9822 LED]
D758  SK9822 LED LINK  [SK9822 LED]
D759  SK9822 LED LINK  [SK9822 LED]
D760  SK9822 LED LINK  [SK9822 LED]
D761  SK9822 LED LINK  [SK9822 LED]
D762  SK9822 LED LINK  [SK9822 LED]
D763  SK9822 LED LINK  [SK9822 LED]
D764  SK9822 LED LINK  [SK9822 LED]
D765  SK9822 LED LINK  [SK9822 LED]
D766  SK9822 LED LINK  [SK9822 LED]
D767  SK9822 LED LINK  [SK9822 LED]
D768  SK9822 LED LINK  [SK9822 LED]
D769  SK9822 LED LINK  [SK9822 LED]
D770  SK9822 LED LINK  [SK9822 LED]
D771  SK9822 LED LINK  [SK9822 LED]
D772  SK9822 LED LINK  [SK9822 LED]
D773  SK9822 LED LINK  [SK9822 LED]
D774  SK9822 LED LINK  [SK9822 LED]
D775  SK9822 LED LINK  [SK9822 LED]
D776  SK9822 LED LINK  [SK9822 LED]
D777  SK9822 LED LINK  [SK9822 LED]
D778  SK9822 LED LINK  [SK9822 LED]
D779  SK9822 LED LINK  [SK9822 LED]
D780  SK9822 LED LINK  [SK9822 LED]
D781  SK9822 LED LINK  [SK9822 LED]
D782  SK9822 LED LINK  [SK9822 LED]
D783  SK9822 LED LINK  [SK9822 LED]
D784  SK9822 LED LINK  [SK9822 LED]
D785  SK9822 LED LINK  [SK9822 LED]
D786  SK9822 LED LINK  [SK9822 LED]
D787  SK9822 LED LINK  [SK9822 LED]
D788  SK9822 LED LINK  [SK9822 LED]
D789  SK9822 LED LINK  [SK9822 LED]
D790  SK9822 LED LINK  [SK9822 LED]
D791  SK9822 LED LINK  [SK9822 LED]
D792  SK9822 LED LINK  [SK9822 LED]
D793  SK9822 LED LINK  [SK9822 LED]
D794  SK9822 LED LINK  [SK9822 LED]
D795  SK9822 LED LINK  [SK9822 LED]
D796  SK9822 LED LINK  [SK9822 LED]
D797  SK9822 LED LINK  [SK9822 LED]
D798  SK9822 LED LINK  [SK9822 LED]
D799  SK9822 LED LINK  [SK9822 LED]
D800  SK9822 LED LINK  [SK9822 LED]
D801  SK9822 LED LINK  [SK9822 LED]
D802  SK9822 LED LINK  [SK9822 LED]
D803  SK9822 LED LINK  [SK9822 LED]
D804  SK9822 LED LINK  [SK9822 LED]
D805  SK9822 LED LINK  [SK9822 LED]
D806  SK9822 LED LINK  [SK9822 LED]
D807  SK9822 LED LINK  [SK9822 LED]
D808  SK9822 LED LINK  [SK9822 LED]
D809  SK9822 LED LINK  [SK9822 LED]
D810  SK9822 LED LINK  [SK9822 LED]
D811  SK9822 LED LINK  [SK9822 LED]
D812  SK9822 LED LINK  [SK9822 LED]
D813  SK9822 LED LINK  [SK9822 LED]
D814  SK9822 LED LINK  [SK9822 LED]
D815  SK9822 LED LINK  [SK9822 LED]
D816  SK9822 LED LINK  [SK9822 LED]
D817  SK9822 LED LINK  [SK9822 LED]
D818  SK9822 LED LINK  [SK9822 LED]
D819  SK9822 LED LINK  [SK9822 LED]
D820  SK9822 LED LINK  [SK9822 LED]
D821  SK9822 LED LINK  [SK9822 LED]
D822  SK9822 LED LINK  [SK9822 LED]
D823  SK9822 LED LINK  [SK9822 LED]
D824  SK9822 LED LINK  [SK9822 LED]
D825  SK9822 LED LINK  [SK9822 LED]
D826  SK9822 LED LINK  [SK9822 LED]
D827  SK9822 LED LINK  [SK9822 LED]
D828  SK9822 LED LINK  [SK9822 LED]
D829  SK9822 LED LINK  [SK9822 LED]
D830  SK9822 LED LINK  [SK9822 LED]
D831  SK9822 LED LINK  [SK9822 LED]
D832  SK9822 LED LINK  [SK9822 LED]
D833  SK9822 LED LINK  [SK9822 LED]
D834  SK9822 LED LINK  [SK9822 LED]
D835  SK9822 LED LINK  [SK9822 LED]
D836  SK9822 LED LINK  [SK9822 LED]
D837  SK9822 LED LINK  [SK9822 LED]
D838  SK9822 LED LINK  [SK9822 LED]
D839  SK9822 LED LINK  [SK9822 LED]
D840  SK9822 LED LINK  [SK9822 LED]
D841  SK9822 LED LINK  [SK9822 LED]
D842  SK9822 LED LINK  [SK9822 LED]
D843  SK9822 LED LINK  [SK9822 LED]
D844  SK9822 LED LINK  [SK9822 LED]
D845  SK9822 LED LINK  [SK9822 LED]
D846  SK9822 LED LINK  [SK9822 LED]
D847  SK9822 LED LINK  [SK9822 LED]
D848  SK9822 LED LINK  [SK9822 LED]
D849  SK9822 LED LINK  [SK9822 LED]
D850  SK9822 LED LINK  [SK9822 LED]
D851  SK9822 LED LINK  [SK9822 LED]
D852  SK9822 LED LINK  [SK9822 LED]
D853  SK9822 LED LINK  [SK9822 LED]
D854  SK9822 LED LINK  [SK9822 LED]
D855  SK9822 LED LINK  [SK9822 LED]
D856  SK9822 LED LINK  [SK9822 LED]
D857  SK9822 LED LINK  [SK9822 LED]
D858  SK9822 LED LINK  [SK9822 LED]
D859  SK9822 LED LINK  [SK9822 LED]
D860  SK9822 LED LINK  [SK9822 LED]
D861  SK9822 LED LINK  [SK9822 LED]
D862  SK9822 LED LINK  [SK9822 LED]
D863  SK9822 LED LINK  [SK9822 LED]
D864  SK9822 LED LINK  [SK9822 LED]
D865  SK9822 LED LINK  [SK9822 LED]
D866  SK9822 LED LINK  [SK9822 LED]
D867  SK9822 LED LINK  [SK9822 LED]
D868  SK9822 LED LINK  [SK9822 LED]
D869  SK9822 LED LINK  [SK9822 LED]
D870  SK9822 LED LINK  [SK9822 LED]
D871  SK9822 LED LINK  [SK9822 LED]
D872  SK9822 LED LINK  [SK9822 LED]
D873  SK9822 LED LINK  [SK9822 LED]
D874  SK9822 LED LINK  [SK9822 LED]
D875  SK9822 LED LINK  [SK9822 LED]
D876  SK9822 LED LINK  [SK9822 LED]
D877  SK9822 LED LINK  [SK9822 LED]
D878  SK9822 LED LINK  [SK9822 LED]
D879  SK9822 LED LINK  [SK9822 LED]
D880  SK9822 LED LINK  [SK9822 LED]
D881  SK9822 LED LINK  [SK9822 LED]
D882  SK9822 LED LINK  [SK9822 LED]
D883  SK9822 LED LINK  [SK9822 LED]
D884  SK9822 LED LINK  [SK9822 LED]
D885  SK9822 LED LINK  [SK9822 LED]
D886  SK9822 LED LINK  [SK9822 LED]
D887  SK9822 LED LINK  [SK9822 LED]
D888  SK9822 LED LINK  [SK9822 LED]
D889  SK9822 LED LINK  [SK9822 LED]
D890  SK9822 LED LINK  [SK9822 LED]
D891  SK9822 LED LINK  [SK9822 LED]
D892  SK9822 LED LINK  [SK9822 LED]
D893  SK9822 LED LINK  [SK9822 LED]
D894  SK9822 LED LINK  [SK9822 LED]
D895  SK9822 LED LINK  [SK9822 LED]
D896  SK9822 LED LINK  [SK9822 LED]
D897  SK9822 LED LINK  [SK9822 LED]
D898  SK9822 LED LINK  [SK9822 LED]
D899  SK9822 LED LINK  [SK9822 LED]
D900  SK9822 LED LINK  [SK9822 LED]
D901  SK9822 LED LINK  [SK9822 LED]
D902  SK9822 LED LINK  [SK9822 LED]
D903  SK9822 LED LINK  [SK9822 LED]
D904  SK9822 LED LINK  [SK9822 LED]
D905  SK9822 LED LINK  [SK9822 LED]
D906  SK9822 LED LINK  [SK9822 LED]
D907  SK9822 LED LINK  [SK9822 LED]
D908  SK9822 LED LINK  [SK9822 LED]
D909  SK9822 LED LINK  [SK9822 LED]
D910  SK9822 LED LINK  [SK9822 LED]
D911  SK9822 LED LINK  [SK9822 LED]
D912  SK9822 LED LINK  [SK9822 LED]
D913  SK9822 LED LINK  [SK9822 LED]
D914  SK9822 LED LINK  [SK9822 LED]
D915  SK9822 LED LINK  [SK9822 LED]
D916  SK9822 LED LINK  [SK9822 LED]
D917  SK9822 LED LINK  [SK9822 LED]
D918  SK9822 LED LINK  [SK9822 LED]
D919  SK9822 LED LINK  [SK9822 LED]
D920  SK9822 LED LINK  [SK9822 LED]
D921  SK9822 LED LINK  [SK9822 LED]
D922  SK9822 LED LINK  [SK9822 LED]
D923  SK9822 LED LINK  [SK9822 LED]
D924  SK9822 LED LINK  [SK9822 LED]
D925  SK9822 LED LINK  [SK9822 LED]
D926  SK9822 LED LINK  [SK9822 LED]
D927  SK9822 LED LINK  [SK9822 LED]
D928  SK9822 LED LINK  [SK9822 LED]
D929  SK9822 LED LINK  [SK9822 LED]
D930  SK9822 LED LINK  [SK9822 LED]
D931  SK9822 LED LINK  [SK9822 LED]
D932  SK9822 LED LINK  [SK9822 LED]
D933  SK9822 LED LINK  [SK9822 LED]
D934  SK9822 LED LINK  [SK9822 LED]
D935  SK9822 LED LINK  [SK9822 LED]
D936  SK9822 LED LINK  [SK9822 LED]
D937  SK9822 LED LINK  [SK9822 LED]
D938  SK9822 LED LINK  [SK9822 LED]
D939  SK9822 LED LINK  [SK9822 LED]
D940  SK9822 LED LINK  [SK9822 LED]
D941  SK9822 LED LINK  [SK9822 LED]
D942  SK9822 LED LINK  [SK9822 LED]
D943  SK9822 LED LINK  [SK9822 LED]
D944  SK9822 LED LINK  [SK9822 LED]
D945  SK9822 LED LINK  [SK9822 LED]
D946  SK9822 LED LINK  [SK9822 LED]
D947  SK9822 LED LINK  [SK9822 LED]
D948  SK9822 LED LINK  [SK9822 LED]
D949  SK9822 LED LINK  [SK9822 LED]
D950  SK9822 LED LINK  [SK9822 LED]
D951  SK9822 LED LINK  [SK9822 LED]
D952  SK9822 LED LINK  [SK9822 LED]
D953  SK9822 LED LINK  [SK9822 LED]
D954  SK9822 LED LINK  [SK9822 LED]
D955  SK9822 LED LINK  [SK9822 LED]
D956  SK9822 LED LINK  [SK9822 LED]
D957  SK9822 LED LINK  [SK9822 LED]
D958  SK9822 LED LINK  [SK9822 LED]
D959  SK9822 LED LINK  [SK9822 LED]
D960  SK9822 LED LINK  [SK9822 LED]
D961  SK9822 LED LINK  [SK9822 LED]
D962  SK9822 LED LINK  [SK9822 LED]
D963  SK9822 LED LINK  [SK9822 LED]
D964  SK9822 LED LINK  [SK9822 LED]
D965  SK9822 LED LINK  [SK9822 LED]
D966  SK9822 LED LINK  [SK9822 LED]
D967  SK9822 LED LINK  [SK9822 LED]
D968  SK9822 LED LINK  [SK9822 LED]
D969  SK9822 LED LINK  [SK9822 LED]
D970  SK9822 LED LINK  [SK9822 LED]
D971  SK9822 LED LINK  [SK9822 LED]
D972  SK9822 LED LINK  [SK9822 LED]
D973  SK9822 LED LINK  [SK9822 LED]
D974  SK9822 LED LINK  [SK9822 LED]
D975  SK9822 LED LINK  [SK9822 LED]
D976  SK9822 LED LINK  [SK9822 LED]
D977  SK9822 LED LINK  [SK9822 LED]
D978  SK9822 LED LINK  [SK9822 LED]
D979  SK9822 LED LINK  [SK9822 LED]
D980  SK9822 LED LINK  [SK9822 LED]
D981  SK9822 LED LINK  [SK9822 LED]
D982  SK9822 LED LINK  [SK9822 LED]
D983  SK9822 LED LINK  [SK9822 LED]
D984  SK9822 LED LINK  [SK9822 LED]
D985  SK9822 LED LINK  [SK9822 LED]
D986  SK9822 LED LINK  [SK9822 LED]
D987  SK9822 LED LINK  [SK9822 LED]
D988  SK9822 LED LINK  [SK9822 LED]
D989  SK9822 LED LINK  [SK9822 LED]
D990  SK9822 LED LINK  [SK9822 LED]
D991  SK9822 LED LINK  [SK9822 LED]
D992  SK9822 LED LINK  [SK9822 LED]
D993  SK9822 LED LINK  [SK9822 LED]
D994  SK9822 LED LINK  [SK9822 LED]
D995  SK9822 LED LINK  [SK9822 LED]
D996  SK9822 LED LINK  [SK9822 LED]
D997  SK9822 LED LINK  [SK9822 LED]
D998  SK9822 LED LINK  [SK9822 LED]
D999  SK9822 LED LINK  [SK9822 LED]
D1000  SK9822 LED LINK  [SK9822 LED]
D1001  SK9822 LED LINK  [SK9822 LED]
D1002  SK9822 LED LINK  [SK9822 LED]
D1003  SK9822 LED LINK  [SK9822 LED]
D1004  SK9822 LED LINK  [SK9822 LED]
D1005  SK9822 LED LINK  [SK9822 LED]
D1006  SK9822 LED LINK  [SK9822 LED]
D1007  SK9822 LED LINK  [SK9822 LED]
D1008  SK9822 LED LINK  [SK9822 LED]
D1009  SK9822 LED LINK  [SK9822 LED]
D1010  SK9822 LED LINK  [SK9822 LED]
D1011  SK9822 LED LINK  [SK9822 LED]
D1012  SK9822 LED LINK  [SK9822 LED]
D1013  SK9822 LED LINK  [SK9822 LED]
D1014  SK9822 LED LINK  [SK9822 LED]
D1015  SK9822 LED LINK  [SK9822 LED]
D1016  SK9822 LED LINK  [SK9822 LED]
D1017  SK9822 LED LINK  [SK9822 LED]
D1018  SK9822 LED LINK  [SK9822 LED]
D1019  SK9822 LED LINK  [SK9822 LED]
D1020  SK9822 LED LINK  [SK9822 LED]
D1021  SK9822 LED LINK  [SK9822 LED]
D1022  SK9822 LED LINK  [SK9822 LED]
D1023  SK9822 LED LINK  [SK9822 LED]
D1024  SK9822 LED LINK  [SK9822 LED]
H1  HDR-F-2.54_1x3  [HARWIN M20-8890345]
J+5V  PJ-036AH-SMT-TR  [CUI PJ-036AH-SMT-TR]

## Library data of the parts
D1-D1024 = SK9822 LED LINK: Manufacturer: Adafruit; Manufacturer Part: 2343; Supplier: Digi-Key; Supplier Part: 1528-1436-ND; link: https://www.digikey.com/products/en?mpart=2343&v=1528; Contributor: rossetyler
H1 = HDR-F-2.54_1x3: Supplier Part: C146690; Supplier: LCSC; Contributor: LCEDA_Lib
J+5V = DC005-2.0MM: Supplier: Digi-Key; Manufacturer: CUI; Supplier Part: CP-036AHPJCT-ND; link: https://www.digikey.com/product-detail/en/cui-devices/PJ-036AH-SMT-TR/CP-036AHPJCT-ND/1530994

## Nets
+5V: D1.4(VCC) D2.4(VCC) D3.4(VCC) D4.4(VCC) D5.4(VCC) D6.4(VCC) D7.4(VCC) D8.4(VCC) D9.4(VCC) D10.4(VCC) D11.4(VCC) D12.4(VCC) D13.4(VCC) D14.4(VCC) D15.4(VCC) D16.4(VCC) D17.4(VCC) D18.4(VCC) D19.4(VCC) D20.4(VCC) D21.4(VCC) D22.4(VCC) D23.4(VCC) D24.4(VCC) D25.4(VCC) D26.4(VCC) D27.4(VCC) D28.4(VCC) D29.4(VCC) D30.4(VCC) D31.4(VCC) D32.4(VCC) D33.4(VCC) D34.4(VCC) D35.4(VCC) D36.4(VCC) D37.4(VCC) D38.4(VCC) D39.4(VCC) D40.4(VCC) D41.4(VCC) D42.4(VCC) D43.4(VCC) D44.4(VCC) D45.4(VCC) D46.4(VCC) D47.4(VCC) D48.4(VCC) D49.4(VCC) D50.4(VCC) D51.4(VCC) D52.4(VCC) D53.4(VCC) D54.4(VCC) D55.4(VCC) D56.4(VCC) D57.4(VCC) D58.4(VCC) D59.4(VCC) D60.4(VCC) D61.4(VCC) D62.4(VCC) D63.4(VCC) D64.4(VCC) D65.4(VCC) D66.4(VCC) D67.4(VCC) D68.4(VCC) D69.4(VCC) D70.4(VCC) D71.4(VCC) D72.4(VCC) D73.4(VCC) D74.4(VCC) D75.4(VCC) D76.4(VCC) D77.4(VCC) D78.4(VCC) D79.4(VCC) D80.4(VCC) D81.4(VCC) D82.4(VCC) D83.4(VCC) D84.4(VCC) D85.4(VCC) D86.4(VCC) D87.4(VCC) D88.4(VCC) D89.4(VCC) D90.4(VCC) D91.4(VCC) D92.4(VCC) D93.4(VCC) D94.4(VCC) D95.4(VCC) D96.4(VCC) D97.4(VCC) D98.4(VCC) D99.4(VCC) D100.4(VCC) D101.4(VCC) D102.4(VCC) D103.4(VCC) D104.4(VCC) D105.4(VCC) D106.4(VCC) D107.4(VCC) D108.4(VCC) D109.4(VCC) D110.4(VCC) D111.4(VCC) D112.4(VCC) D113.4(VCC) D114.4(VCC) D115.4(VCC) D116.4(VCC) D117.4(VCC) D118.4(VCC) D119.4(VCC) D120.4(VCC) D121.4(VCC) D122.4(VCC) D123.4(VCC) D124.4(VCC) D125.4(VCC) D126.4(VCC) D127.4(VCC) D128.4(VCC) D129.4(VCC) D130.4(VCC) D131.4(VCC) D132.4(VCC) D133.4(VCC) D134.4(VCC) D135.4(VCC) D136.4(VCC) D137.4(VCC) D138.4(VCC) D139.4(VCC) D140.4(VCC) D141.4(VCC) D142.4(VCC) D143.4(VCC) D144.4(VCC) D145.4(VCC) D146.4(VCC) D147.4(VCC) D148.4(VCC) D149.4(VCC) D150.4(VCC) D151.4(VCC) D152.4(VCC) D153.4(VCC) D154.4(VCC) D155.4(VCC) D156.4(VCC) D157.4(VCC) D158.4(VCC) D159.4(VCC) D160.4(VCC) D161.4(VCC) D162.4(VCC) D163.4(VCC) D164.4(VCC) D165.4(VCC) D166.4(VCC) D167.4(VCC) D168.4(VCC) D169.4(VCC) D170.4(VCC) D171.4(VCC) D172.4(VCC) D173.4(VCC) D174.4(VCC) D175.4(VCC) D176.4(VCC) D177.4(VCC) D178.4(VCC) D179.4(VCC) D180.4(VCC) D181.4(VCC) D182.4(VCC) D183.4(VCC) D184.4(VCC) D185.4(VCC) D186.4(VCC) D187.4(VCC) D188.4(VCC) D189.4(VCC) D190.4(VCC) D191.4(VCC) D192.4(VCC) D193.4(VCC) D194.4(VCC) D195.4(VCC) D196.4(VCC) D197.4(VCC) D198.4(VCC) D199.4(VCC) D200.4(VCC) D201.4(VCC) D202.4(VCC) D203.4(VCC) D204.4(VCC) D205.4(VCC) D206.4(VCC) D207.4(VCC) D208.4(VCC) D209.4(VCC) D210.4(VCC) D211.4(VCC) D212.4(VCC) D213.4(VCC) D214.4(VCC) D215.4(VCC) D216.4(VCC) D217.4(VCC) D218.4(VCC) D219.4(VCC) D220.4(VCC) D221.4(VCC) D222.4(VCC) D223.4(VCC) D224.4(VCC) D225.4(VCC) D226.4(VCC) D227.4(VCC) D228.4(VCC) D229.4(VCC) D230.4(VCC) D231.4(VCC) D232.4(VCC) D233.4(VCC) D234.4(VCC) D235.4(VCC) D236.4(VCC) D237.4(VCC) D238.4(VCC) D239.4(VCC) D240.4(VCC) D241.4(VCC) D242.4(VCC) D243.4(VCC) D244.4(VCC) D245.4(VCC) D246.4(VCC) D247.4(VCC) D248.4(VCC) D249.4(VCC) D250.4(VCC) D251.4(VCC) D252.4(VCC) D253.4(VCC) D254.4(VCC) D255.4(VCC) D256.4(VCC) D257.4(VCC) D258.4(VCC) D259.4(VCC) D260.4(VCC) D261.4(VCC) D262.4(VCC) D263.4(VCC) D264.4(VCC) D265.4(VCC) D266.4(VCC) D267.4(VCC) D268.4(VCC) D269.4(VCC) D270.4(VCC) D271.4(VCC) D272.4(VCC) D273.4(VCC) D274.4(VCC) D275.4(VCC) D276.4(VCC) D277.4(VCC) D278.4(VCC) D279.4(VCC) D280.4(VCC) D281.4(VCC) D282.4(VCC) D283.4(VCC) D284.4(VCC) D285.4(VCC) D286.4(VCC) D287.4(VCC) D288.4(VCC) D289.4(VCC) D290.4(VCC) D291.4(VCC) D292.4(VCC) D293.4(VCC) D294.4(VCC) D295.4(VCC) D296.4(VCC) D297.4(VCC) D298.4(VCC) D299.4(VCC) D300.4(VCC) D301.4(VCC) D302.4(VCC) D303.4(VCC) D304.4(VCC) D305.4(VCC) D306.4(VCC) D307.4(VCC) D308.4(VCC) D309.4(VCC) D310.4(VCC) D311.4(VCC) D312.4(VCC) D313.4(VCC) D314.4(VCC) D315.4(VCC) D316.4(VCC) D317.4(VCC) D318.4(VCC) D319.4(VCC) D320.4(VCC) D321.4(VCC) D322.4(VCC) D323.4(VCC) D324.4(VCC) D325.4(VCC) D326.4(VCC) D327.4(VCC) D328.4(VCC) D329.4(VCC) D330.4(VCC) D331.4(VCC) D332.4(VCC) D333.4(VCC) D334.4(VCC) D335.4(VCC) D336.4(VCC) D337.4(VCC) D338.4(VCC) D339.4(VCC) D340.4(VCC) D341.4(VCC) D342.4(VCC) D343.4(VCC) D344.4(VCC) D345.4(VCC) D346.4(VCC) D347.4(VCC) D348.4(VCC) D349.4(VCC) D350.4(VCC) D351.4(VCC) D352.4(VCC) D353.4(VCC) D354.4(VCC) D355.4(VCC) D356.4(VCC) D357.4(VCC) D358.4(VCC) D359.4(VCC) D360.4(VCC) D361.4(VCC) D362.4(VCC) D363.4(VCC) D364.4(VCC) D365.4(VCC) D366.4(VCC) D367.4(VCC) D368.4(VCC) D369.4(VCC) D370.4(VCC) D371.4(VCC) D372.4(VCC) D373.4(VCC) D374.4(VCC) D375.4(VCC) D376.4(VCC) D377.4(VCC) D378.4(VCC) D379.4(VCC) D380.4(VCC) D381.4(VCC) D382.4(VCC) D383.4(VCC) D384.4(VCC) D385.4(VCC) D386.4(VCC) D387.4(VCC) D388.4(VCC) D389.4(VCC) D390.4(VCC) D391.4(VCC) D392.4(VCC) D393.4(VCC) D394.4(VCC) D395.4(VCC) D396.4(VCC) D397.4(VCC) D398.4(VCC) D399.4(VCC) D400.4(VCC) D401.4(VCC) D402.4(VCC) D403.4(VCC) D404.4(VCC) D405.4(VCC) D406.4(VCC) D407.4(VCC) D408.4(VCC) D409.4(VCC) D410.4(VCC) D411.4(VCC) D412.4(VCC) D413.4(VCC) D414.4(VCC) D415.4(VCC) D416.4(VCC) D417.4(VCC) D418.4(VCC) D419.4(VCC) D420.4(VCC) D421.4(VCC) D422.4(VCC) D423.4(VCC) D424.4(VCC) D425.4(VCC) D426.4(VCC) D427.4(VCC) D428.4(VCC) D429.4(VCC) D430.4(VCC) D431.4(VCC) D432.4(VCC) D433.4(VCC) D434.4(VCC) D435.4(VCC) D436.4(VCC) D437.4(VCC) D438.4(VCC) D439.4(VCC) D440.4(VCC) D441.4(VCC) D442.4(VCC) D443.4(VCC) D444.4(VCC) D445.4(VCC) D446.4(VCC) D447.4(VCC) D448.4(VCC) D449.4(VCC) D450.4(VCC) D451.4(VCC) D452.4(VCC) D453.4(VCC) D454.4(VCC) D455.4(VCC) D456.4(VCC) D457.4(VCC) D458.4(VCC) D459.4(VCC) D460.4(VCC) D461.4(VCC) D462.4(VCC) D463.4(VCC) D464.4(VCC) D465.4(VCC) D466.4(VCC) D467.4(VCC) D468.4(VCC) D469.4(VCC) D470.4(VCC) D471.4(VCC) D472.4(VCC) D473.4(VCC) D474.4(VCC) D475.4(VCC) D476.4(VCC) D477.4(VCC) D478.4(VCC) D479.4(VCC) D480.4(VCC) D481.4(VCC) D482.4(VCC) D483.4(VCC) D484.4(VCC) D485.4(VCC) D486.4(VCC) D487.4(VCC) D488.4(VCC) D489.4(VCC) D490.4(VCC) D491.4(VCC) D492.4(VCC) D493.4(VCC) D494.4(VCC) D495.4(VCC) D496.4(VCC) D497.4(VCC) D498.4(VCC) D499.4(VCC) D500.4(VCC) D501.4(VCC) D502.4(VCC) D503.4(VCC) D504.4(VCC) D505.4(VCC) D506.4(VCC) D507.4(VCC) D508.4(VCC) D509.4(VCC) D510.4(VCC) D511.4(VCC) D512.4(VCC) D513.4(VCC) D514.4(VCC) D515.4(VCC) D516.4(VCC) D517.4(VCC) D518.4(VCC) D519.4(VCC) D520.4(VCC) D521.4(VCC) D522.4(VCC) D523.4(VCC) D524.4(VCC) D525.4(VCC) D526.4(VCC) D527.4(VCC) D528.4(VCC) D529.4(VCC) D530.4(VCC) D531.4(VCC) D532.4(VCC) D533.4(VCC) D534.4(VCC) D535.4(VCC) D536.4(VCC) D537.4(VCC) D538.4(VCC) D539.4(VCC) D540.4(VCC) D541.4(VCC) D542.4(VCC) D543.4(VCC) D544.4(VCC) D545.4(VCC) D546.4(VCC) D547.4(VCC) D548.4(VCC) D549.4(VCC) D550.4(VCC) D551.4(VCC) D552.4(VCC) D553.4(VCC) D554.4(VCC) D555.4(VCC) D556.4(VCC) D557.4(VCC) D558.4(VCC) D559.4(VCC) D560.4(VCC) D561.4(VCC) D562.4(VCC) D563.4(VCC) D564.4(VCC) D565.4(VCC) D566.4(VCC) D567.4(VCC) D568.4(VCC) D569.4(VCC) D570.4(VCC) D571.4(VCC) D572.4(VCC) D573.4(VCC) D574.4(VCC) D575.4(VCC) D576.4(VCC) D577.4(VCC) D578.4(VCC) D579.4(VCC) D580.4(VCC) D581.4(VCC) D582.4(VCC) D583.4(VCC) D584.4(VCC) D585.4(VCC) D586.4(VCC) D587.4(VCC) D588.4(VCC) D589.4(VCC) D590.4(VCC) D591.4(VCC) D592.4(VCC) D593.4(VCC) D594.4(VCC) D595.4(VCC) D596.4(VCC) D597.4(VCC) D598.4(VCC) D599.4(VCC) D600.4(VCC) D601.4(VCC) D602.4(VCC) D603.4(VCC) D604.4(VCC) D605.4(VCC) D606.4(VCC) D607.4(VCC) D608.4(VCC) D609.4(VCC) D610.4(VCC) D611.4(VCC) D612.4(VCC) D613.4(VCC) D614.4(VCC) D615.4(VCC) D616.4(VCC) D617.4(VCC) D618.4(VCC) D619.4(VCC) D620.4(VCC) D621.4(VCC) D622.4(VCC) D623.4(VCC) D624.4(VCC) D625.4(VCC) D626.4(VCC) D627.4(VCC) D628.4(VCC) D629.4(VCC) D630.4(VCC) D631.4(VCC) D632.4(VCC) D633.4(VCC) D634.4(VCC) D635.4(VCC) D636.4(VCC) D637.4(VCC) D638.4(VCC) D639.4(VCC) D640.4(VCC) D641.4(VCC) D642.4(VCC) D643.4(VCC) D644.4(VCC) D645.4(VCC) D646.4(VCC) D647.4(VCC) D648.4(VCC) D649.4(VCC) D650.4(VCC) D651.4(VCC) D652.4(VCC) D653.4(VCC) D654.4(VCC) D655.4(VCC) D656.4(VCC) D657.4(VCC) D658.4(VCC) D659.4(VCC) D660.4(VCC) D661.4(VCC) D662.4(VCC) D663.4(VCC) D664.4(VCC) D665.4(VCC) D666.4(VCC) D667.4(VCC) D668.4(VCC) D669.4(VCC) D670.4(VCC) D671.4(VCC) D672.4(VCC) D673.4(VCC) D674.4(VCC) D675.4(VCC) D676.4(VCC) D677.4(VCC) D678.4(VCC) D679.4(VCC) D680.4(VCC) D681.4(VCC) D682.4(VCC) D683.4(VCC) D684.4(VCC) D685.4(VCC) D686.4(VCC) D687.4(VCC) D688.4(VCC) D689.4(VCC) D690.4(VCC) D691.4(VCC) D692.4(VCC) D693.4(VCC) D694.4(VCC) D695.4(VCC) D696.4(VCC) D697.4(VCC) D698.4(VCC) D699.4(VCC) D700.4(VCC) D701.4(VCC) D702.4(VCC) D703.4(VCC) D704.4(VCC) D705.4(VCC) D706.4(VCC) D707.4(VCC) D708.4(VCC) D709.4(VCC) D710.4(VCC) D711.4(VCC) D712.4(VCC) D713.4(VCC) D714.4(VCC) D715.4(VCC) D716.4(VCC) D717.4(VCC) D718.4(VCC) D719.4(VCC) D720.4(VCC) D721.4(VCC) D722.4(VCC) D723.4(VCC) D724.4(VCC) D725.4(VCC) D726.4(VCC) D727.4(VCC) D728.4(VCC) D729.4(VCC) D730.4(VCC) D731.4(VCC) D732.4(VCC) D733.4(VCC) D734.4(VCC) D735.4(VCC) D736.4(VCC) D737.4(VCC) D738.4(VCC) D739.4(VCC) D740.4(VCC) D741.4(VCC) D742.4(VCC) D743.4(VCC) D744.4(VCC) D745.4(VCC) D746.4(VCC) D747.4(VCC) D748.4(VCC) D749.4(VCC) D750.4(VCC) D751.4(VCC) D752.4(VCC) D753.4(VCC) D754.4(VCC) D755.4(VCC) D756.4(VCC) D757.4(VCC) D758.4(VCC) D759.4(VCC) D760.4(VCC) D761.4(VCC) D762.4(VCC) D763.4(VCC) D764.4(VCC) D765.4(VCC) D766.4(VCC) D767.4(VCC) D768.4(VCC) D769.4(VCC) D770.4(VCC) D771.4(VCC) D772.4(VCC) D773.4(VCC) D774.4(VCC) D775.4(VCC) D776.4(VCC) D777.4(VCC) D778.4(VCC) D779.4(VCC) D780.4(VCC) D781.4(VCC) D782.4(VCC) D783.4(VCC) D784.4(VCC) D785.4(VCC) D786.4(VCC) D787.4(VCC) D788.4(VCC) D789.4(VCC) D790.4(VCC) D791.4(VCC) D792.4(VCC) D793.4(VCC) D794.4(VCC) D795.4(VCC) D796.4(VCC) D797.4(VCC) D798.4(VCC) D799.4(VCC) D800.4(VCC) D801.4(VCC) D802.4(VCC) D803.4(VCC) D804.4(VCC) D805.4(VCC) D806.4(VCC) D807.4(VCC) D808.4(VCC) D809.4(VCC) D810.4(VCC) D811.4(VCC) D812.4(VCC) D813.4(VCC) D814.4(VCC) D815.4(VCC) D816.4(VCC) D817.4(VCC) D818.4(VCC) D819.4(VCC) D820.4(VCC) D821.4(VCC) D822.4(VCC) D823.4(VCC) D824.4(VCC) D825.4(VCC) D826.4(VCC) D827.4(VCC) D828.4(VCC) D829.4(VCC) D830.4(VCC) D831.4(VCC) D832.4(VCC) D833.4(VCC) D834.4(VCC) D835.4(VCC) D836.4(VCC) D837.4(VCC) D838.4(VCC) D839.4(VCC) D840.4(VCC) D841.4(VCC) D842.4(VCC) D843.4(VCC) D844.4(VCC) D845.4(VCC) D846.4(VCC) D847.4(VCC) D848.4(VCC) D849.4(VCC) D850.4(VCC) D851.4(VCC) D852.4(VCC) D853.4(VCC) D854.4(VCC) D855.4(VCC) D856.4(VCC) D857.4(VCC) D858.4(VCC) D859.4(VCC) D860.4(VCC) D861.4(VCC) D862.4(VCC) D863.4(VCC) D864.4(VCC) D865.4(VCC) D866.4(VCC) D867.4(VCC) D868.4(VCC) D869.4(VCC) D870.4(VCC) D871.4(VCC) D872.4(VCC) D873.4(VCC) D874.4(VCC) D875.4(VCC) D876.4(VCC) D877.4(VCC) D878.4(VCC) D879.4(VCC) D880.4(VCC) D881.4(VCC) D882.4(VCC) D883.4(VCC) D884.4(VCC) D885.4(VCC) D886.4(VCC) D887.4(VCC) D888.4(VCC) D889.4(VCC) D890.4(VCC) D891.4(VCC) D892.4(VCC) D893.4(VCC) D894.4(VCC) D895.4(VCC) D896.4(VCC) D897.4(VCC) D898.4(VCC) D899.4(VCC) D900.4(VCC) D901.4(VCC) D902.4(VCC) D903.4(VCC) D904.4(VCC) D905.4(VCC) D906.4(VCC) D907.4(VCC) D908.4(VCC) D909.4(VCC) D910.4(VCC) D911.4(VCC) D912.4(VCC) D913.4(VCC) D914.4(VCC) D915.4(VCC) D916.4(VCC) D917.4(VCC) D918.4(VCC) D919.4(VCC) D920.4(VCC) D921.4(VCC) D922.4(VCC) D923.4(VCC) D924.4(VCC) D925.4(VCC) D926.4(VCC) D927.4(VCC) D928.4(VCC) D929.4(VCC) D930.4(VCC) D931.4(VCC) D932.4(VCC) D933.4(VCC) D934.4(VCC) D935.4(VCC) D936.4(VCC) D937.4(VCC) D938.4(VCC) D939.4(VCC) D940.4(VCC) D941.4(VCC) D942.4(VCC) D943.4(VCC) D944.4(VCC) D945.4(VCC) D946.4(VCC) D947.4(VCC) D948.4(VCC) D949.4(VCC) D950.4(VCC) D951.4(VCC) D952.4(VCC) D953.4(VCC) D954.4(VCC) D955.4(VCC) D956.4(VCC) D957.4(VCC) D958.4(VCC) D959.4(VCC) D960.4(VCC) D961.4(VCC) D962.4(VCC) D963.4(VCC) D964.4(VCC) D965.4(VCC) D966.4(VCC) D967.4(VCC) D968.4(VCC) D969.4(VCC) D970.4(VCC) D971.4(VCC) D972.4(VCC) D973.4(VCC) D974.4(VCC) D975.4(VCC) D976.4(VCC) D977.4(VCC) D978.4(VCC) D979.4(VCC) D980.4(VCC) D981.4(VCC) D982.4(VCC) D983.4(VCC) D984.4(VCC) D985.4(VCC) D986.4(VCC) D987.4(VCC) D988.4(VCC) D989.4(VCC) D990.4(VCC) D991.4(VCC) D992.4(VCC) D993.4(VCC) D994.4(VCC) D995.4(VCC) D996.4(VCC) D997.4(VCC) D998.4(VCC) D999.4(VCC) D1000.4(VCC) D1001.4(VCC) D1002.4(VCC) D1003.4(VCC) D1004.4(VCC) D1005.4(VCC) D1006.4(VCC) D1007.4(VCC) D1008.4(VCC) D1009.4(VCC) D1010.4(VCC) D1011.4(VCC) D1012.4(VCC) D1013.4(VCC) D1014.4(VCC) D1015.4(VCC) D1016.4(VCC) D1017.4(VCC) D1018.4(VCC) D1019.4(VCC) D1020.4(VCC) D1021.4(VCC) D1022.4(VCC) D1023.4(VCC) D1024.4(VCC) J+5V.1
